# EasyEDA schematic SCH_ESP-RotaryCell-Main-Carrier-Rev-A1.2b_upload.json
TITLE: Sheet_1; REV: 1.0; Date: 2026-08-07; Sheet: 1/1; Drawn By: evilroot; Company: Your Company
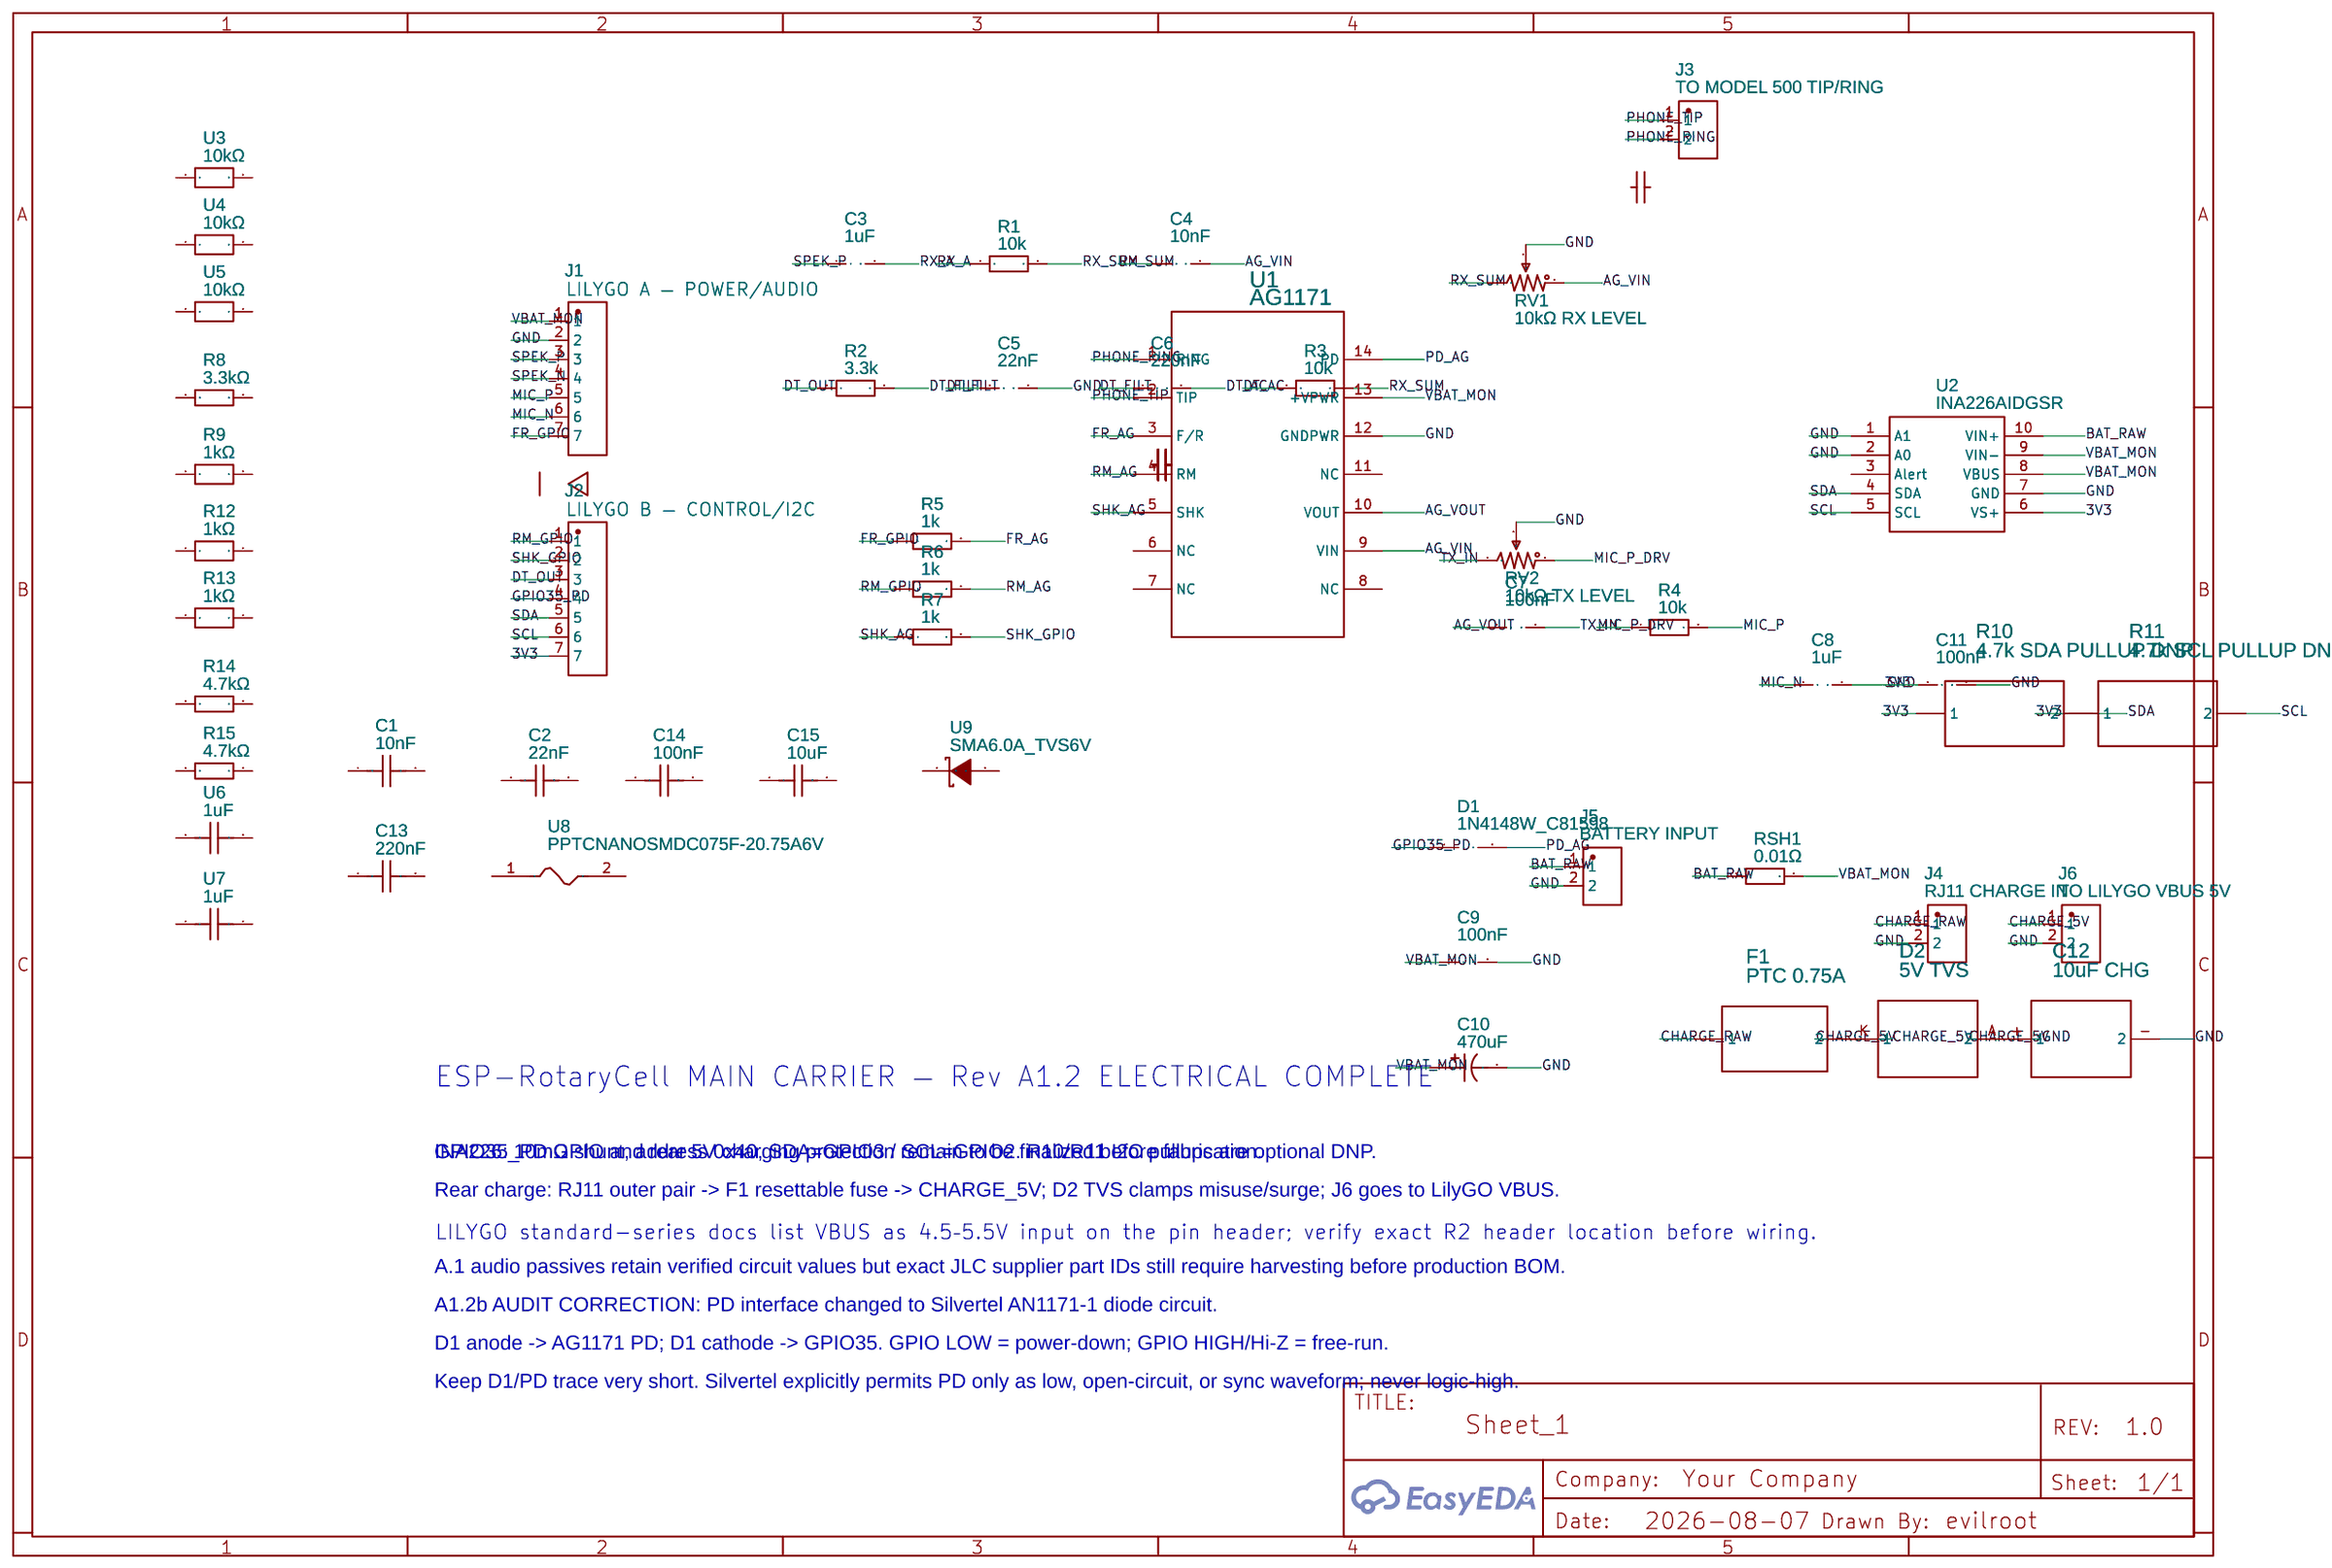
[diagram p0: schematic sheet]

## Parts
C1  10nF  [C0805]
C2  22nF  [C0805]
C3  1uF  [C0805]
C4  10nF  [C0805]
C5  22nF  [C0805]
C6  220nF  [C0805]
C7  100nF  [C0805]
C8  1uF  [C0805]
C9  100nF  [C0805]
C10  470uF  [CAP-TH_BD5.5-P2.50-D0.5-FD_RYHT16V470UF5.5X11]
C11  100nF  [C0805]
C12  10uF CHG  [C0805]
C13  220nF  [C0805]
C14  100nF  [C0805]
C15  10uF  [C0805]
D1  1N4148W_C81598  [SOD-123F_L2.7-W1.6-LS3.8-RD]
D2  5V TVS  [SMA]
F1  PTC 0.75A  [FUSE_1206]
J1  LILYGO A — POWER/AUDIO  [HDR-TH_7P-P2.54-V-F_PM2.54-1X7PZZ-H8.5]
J2  LILYGO B — CONTROL/I2C  [HDR-TH_7P-P2.54-V-F_PM2.54-1X7PZZ-H8.5]
J3  TO MODEL 500 TIP/RING  [HDR-TH_HMT-2.54-1X2PM]
J4  RJ11 CHARGE IN  [HDR-TH_HMT-2.54-1X2PM]
J5  BATTERY INPUT  [HDR-TH_HMT-2.54-1X2PM]
J6  TO LILYGO VBUS 5V  [HDR-TH_HMT-2.54-1X2PM]
R1  10k  [R0805]
R2  3.3k  [R0805]
R3  10k  [R0805]
R4  10k  [R0805]
R5  1k  [R0805]
R6  1k  [R0805]
R7  1k  [R0805]
R8  3.3kΩ  [R0805]
R9  1kΩ  [R0805]
R10  4.7k SDA PULLUP DNP  [R0805]
R11  4.7k SCL PULLUP DNP  [R0805]
R12  1kΩ  [R0805]
R13  1kΩ  [R0805]
R14  4.7kΩ  [R0805]
R15  4.7kΩ  [R0805]
RSH1  0.01Ω  [R2512]
RV1  10kΩ RX LEVEL  [RES-ADJ-SMD_PS10KV50-104A3030-PM]
RV2  10kΩ TX LEVEL  [RES-ADJ-SMD_PS10KV50-104A3030-PM]
U1  AG1171  [AG1171_SILVERTEL_THT_14P]
U2  INA226AIDGSR  [MSOP-10_L3.0-W3.0-P0.50-LS5.0-BL]
U3  10kΩ  [R0805]
U4  10kΩ  [R0805]
U5  10kΩ  [R0805]
U6  1uF  [C0805]
U7  1uF  [C0805]
U8  PPTCNANOSMDC075F-20.75A6V  [F1206]
U9  SMA6.0A_TVS6V  [SMA_L4.4-W2.6-LS5.0-RD]

## Library data of the parts
C1 = CGA0805X7R103J500KT: Supplier: LCSC; Supplier Part: C47117446; Manufacturer: HRE(芯声); JLCPCB Part Class: Extended Part; Contributor: lcsc
C2 = CGA0805C0G223J500MT: Supplier: LCSC; Supplier Part: C36911374; Manufacturer: HRE(芯声); JLCPCB Part Class: Extended Part; Contributor: lcsc
C3-C9 C11 = -: Contributor: LCSC
C10 = RYHT16V470UF5.5*11: Supplier: LCSC; Supplier Part: C48970554; Manufacturer: HONOR(荣誉); JLCPCB Part Class: Extended Part; Contributor: lcsc
C12 D2 F1 R10 R11 = -: Contributor: OpenAI
C13 = CGA0805X7R224K101MT: Supplier: LCSC; Supplier Part: C6119933; Manufacturer: HRE(芯声); Contributor: lcsc; JLCPCB Part Class: Extended Part
C14 = CAI0805X7R104K500KT: Supplier: LCSC; Supplier Part: C7496660; Manufacturer: HRE(芯声); Contributor: lcsc
C15 = CGA0805X5R106K160MT: Supplier: LCSC; Supplier Part: C6119886; Manufacturer: HRE(芯声); Contributor: lcsc; JLCPCB Part Class: Extended Part
D1 = 1N4148W_C81598: Supplier: LCSC; Manufacturer: ST(先科); Manufacturer Part: 1N4148W; Supplier Part: C81598; JLCPCB Part Class: Basic Part
J1 J2 = PM2.54-1X7PZZ-H8.5: Supplier: LCSC; Supplier Part: C54876729; Manufacturer: SHOU HAN(首韩); Manufacturer Part: PM2.54-1x7PZZ-H8.5; JLCPCB Part Class: Extended Part; Contributor: lcsc
J3-J6 = HMT-2.54-1*2PM: Supplier: LCSC; Supplier Part: C54620389; Manufacturer: HMTCONN(华明通); Contributor: lcsc; JLCPCB Part Class: Extended Part
R8 = RMC08053.3K1%N: Contributor: LCSC; Supplier: LCSC; Supplier Part: C269541; Manufacturer: Tyohm(幸亚电阻); JLCPCB Part Class: Extended Part
R9 R12 R13 = CL0805JN1KPS: Supplier: LCSC; Supplier Part: C50397181; Manufacturer: 昶龙科技; JLCPCB Part Class: Extended Part; Contributor: lcsc
R14 R15 = RMC08054.7K1%N: Contributor: LCSC; Supplier: LCSC; Supplier Part: C269746; Manufacturer: Tyohm(幸亚电阻); JLCPCB Part Class: Extended Part
RSH1 = MRF6432(2512)LR010JTS: Supplier Part: C76272; Supplier: LCSC; Manufacturer: SUP; JLCPCB Part Class: Extended Part
RV1 RV2 = PS10KV50-103A3030: Supplier: LCSC; Supplier Part: C7261862; Manufacturer: Amphenol; Contributor: lcsc; JLCPCB Part Class: Extended Part
U1 = AG1171: Manufacturer: Silver Telecom; Manufacturer Part: Ag1171; Contributor: evilroot
U2 = INA226AIDGSR: Supplier: LCSC; Manufacturer: TI(德州仪器); Supplier Part: C49851; JLCPCB Part Class: Extended Part
U3-U5 = RCS080510K0FKEA: Supplier: LCSC; Supplier Part: C4320396; Manufacturer: VISHAY(威世); JLCPCB Part Class: Extended Part; Contributor: lcsc
U6 U7 = C0805C105K5RACAUTO: Supplier: LCSC; Supplier Part: C3874210; Manufacturer: KEMET(基美); JLCPCB Part Class: Extended Part; Contributor: lcsc
U8 = PPTCNANOSMDC075F-20.75A6V: Contributor: lcsc; Supplier: LCSC; Supplier Part: C9900014746; Manufacturer: null; JLCPCB Part Class: Extended Part
U9 = SMA6.0A_TVS6V: Contributor: lcsc; Supplier: LCSC; Supplier Part: C9900019684; Manufacturer: null; JLCPCB Part Class: Extended Part

## Nets
3V3: C5.2 C8.2 C9.2 C10.2 C11.1 C11.2 C12.-(2) D2.A(2) J1.2 J2.5 J2.6 J2.7 J4.2 J5.2 J6.2 R10.(2) R11.(2) RV1.3 RV2.3 U1.12(GNDPWR) U2.1(A1) U2.2(A0) U2.4(SDA) U2.5(SCL) U2.6(VS+) U2.7(GND)
VBAT_MON: C9.1 C10.1 J1.1 RSH1.2 U1.13(+VPWR) U2.8(VBUS) U2.9(VIN-)
AG_VIN: C4.2 RV1.2 U1.9(VIN)
AG_VOUT: C7.1 U1.10(VOUT)
BAT_RAW: J5.1 RSH1.1 U2.10(VIN+)
CHARGE_5V: C12.+(1) D2.K(1) F1.(2) J4.1 J6.1
DT_AC: C6.2 R3.1
DT_FILT: C5.1 C6.1 R2.2
DT_OUT: J2.3 R2.1
FR_AG: R5.2 U1.3(F/R)
FR_GPIO: J1.7 R5.1
GPIO35_PD: D1.1(K) J2.4
MIC_N: C8.1 J1.6
MIC_P: J1.5 R4.2
MIC_P_DRV: R4.1 RV2.2
PD_AG: D1.2(A) U1.14(PD)
PHONE_RING: J3.2 U1.1(RING)
PHONE_TIP: J3.1 U1.2(TIP)
RM_AG: R6.2 U1.4(RM)
RM_GPIO: J2.1 R6.1
RX_A: C3.2 R1.1
RX_SUM: C4.1 R1.2 R3.2 RV1.1
SHK_AG: R7.1 U1.5(SHK)
SHK_GPIO: J2.2 R7.2
SPEK_N: J1.4
SPEK_P: C3.1 J1.3
TX_IN: C7.2 RV2.1

Not connected (* = marked no-connect by the designer): C1 1 2; C2 1 2; C13 1 2; C14 1 2; C15 1 2; R8 1 2; R9 1 2; R12 1 2; R13 1 2; R14 1 2; R15 1 2; U1 6(NC) 7(NC) 8(NC) 11(NC); U2 3(Alert); U3 1 2; U4 1 2; U5 1 2; U6 1 2; U7 1 2; U8 1 2; U9 1(C) 2(A)

## Notes on the sheet
- ESP-RotaryCell MAIN CARRIER — Rev A1.2 ELECTRICAL COMPLETE
- GPIO35_PD GPIO and rear 5V charging protection remain to be finalized before fabrication.
- INA226: 10mΩ shunt, address 0x40, SDA=GPIO3 / SCL=GPIO2. R10/R11 I2C pullups are optional DNP.
- Rear charge: RJ11 outer pair -> F1 resettable fuse -> CHARGE_5V; D2 TVS clamps misuse/surge; J6 goes to LilyGO VBUS.
- LILYGO standard-series docs list VBUS as 4.5–5.5V input on the pin header; verify exact R2 header location before wiring.
- A.1 audio passives retain verified circuit values but exact JLC supplier part IDs still require harvesting before production BOM.
- A1.2b AUDIT CORRECTION: PD interface changed to Silvertel AN1171-1 diode circuit.
- D1 anode -> AG1171 PD; D1 cathode -> GPIO35. GPIO LOW = power-down; GPIO HIGH/Hi-Z = free-run.
- Keep D1/PD trace very short. Silvertel explicitly permits PD only as low, open-circuit, or sync waveform; never logic-high.
